# Altium schematic sheet power_supply.SchDoc: Power supply & supervisor
size 297 x 209 mm; CheckedBy: -; CompanyName: CERN; DrawnBy: GK; Organization: CERN; Address1: European Organization for Nuclear Research; Address2: CH-1211 Geneve 23 - Switzerland; DocumentNumber: 10; Revision: -; SheetNumber: 5; SheetTotal: 9; EDA_Number: EDA-02667-V2-0; Projet: FMC Delay 1ns 4cha; ModifiedBy: -; CheckedDate: -; Title2: -; DivGrp: BE-CO; Designer: GK; ModifiedDate: -
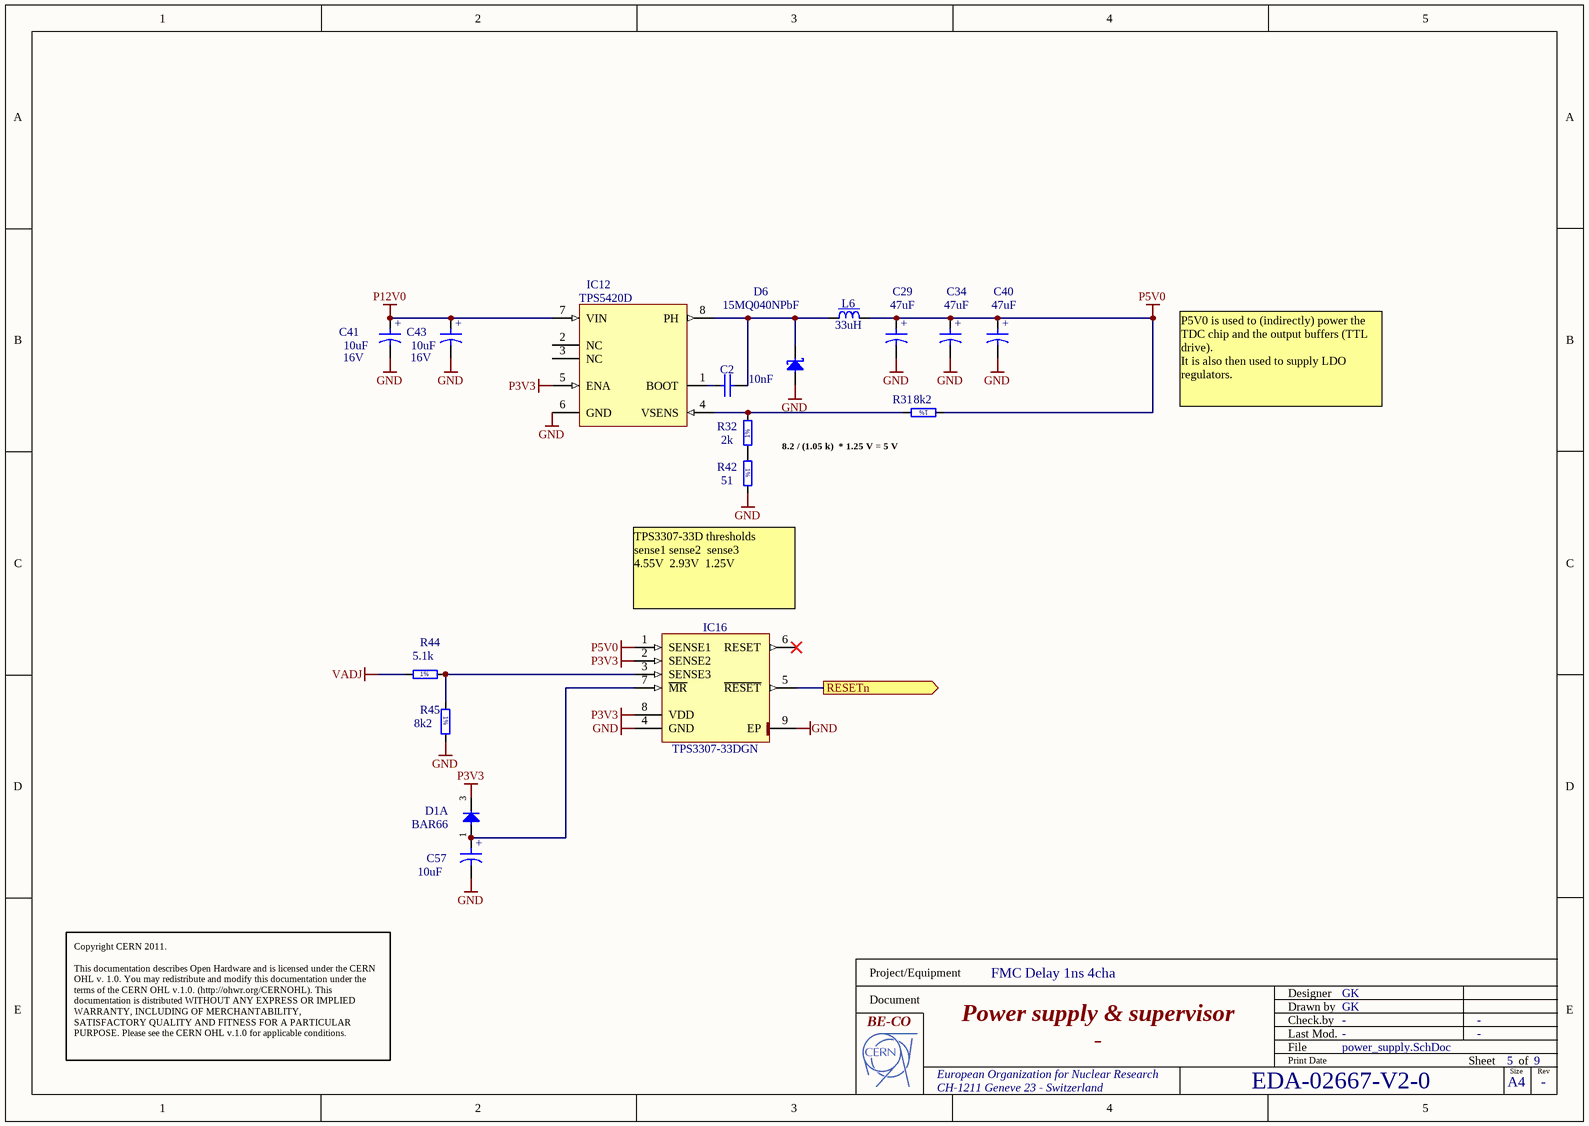
[diagram p0: power_supply.SchDoc]

## Parts
C2  10nF  [CAPC1608X87N]
C29  47uF  [CAPMP3528X210N]
C34  47uF  [CAPMP3528X210N]
C40  47uF  [CAPMP3528X210N]
C41  10uF  Voltage: 16V  [CAPMP3528X210N]
C43  10uF  Voltage: 16V  [CAPMP3528X210N]
C57  10uF  [CAPMP3216X180N]
D1  BAR66  [SOT95P240X110-3N]  (part A of 2)
D6  15MQ040NPbF  [DIOM5027X244N]
IC12  TPS5420D  [SOIC127P600X175-8N]
IC16  TPS3307-33DGN  [SOP65P490X110-9N-R157X189]
L6  33uH  [IND_MURATA-PS_4500]
R31  8k2  [RESC1608X55N]
R32  2k  [RESC1608X55N]
R42  51  [RESC1608X55N]
R44  5.1k  [RESC1608X55N]
R45  8k2  [RESC1608X55N]

## Ports
RESETn (out)

## Nets
GND: C29.2 C34.2 C40.2 C41.2 C43.2 C57.2 D6.2(A) IC12.6(GND) IC16.4(GND) IC16.9(EP) R42.2 R45.2
P3V3: D1.3(COMAC) IC12.5(ENA) IC16.2(SENSE2) IC16.8(VDD)
P5V0: C29.1 C34.1 C40.1 IC16.1(SENSE1) L6.2 R31.1
P12V0: C41.1 C43.1 IC12.7(VIN)
VADJ: R44.1
RESETn: IC16.5(~{RESET}) ; port RESETn
NetC2_1: C2.1 IC12.1(BOOT)
NetC2_2: C2.2 D6.1(C) IC12.8(PH) L6.1
NetC57_1: C57.1 D1.1(A) IC16.7(~{MR})
NetIC12_4: IC12.4(VSENS) R31.2 R32.2
NetIC16_3: IC16.3(SENSE3) R44.2 R45.1
NetR32_1: R32.1 R42.1

Not connected (* = marked no-connect by the designer): IC12 2(NC) 3(NC); IC16 6(RESET)*

## Notes on the sheet
- P5V0 is used to (indirectly) power the TDC chip and the output buffers (TTL drive).
  It is also then used to supply LDO regulators.
- 8.2 / (1.05 k)  * 1.25 V = 5 V
- TPS3307-33D thresholds
  sense1	sense2 	sense3
  4.55V 	2.93V 	1.25V
- Copyright CERN 2011.
  This documentation describes Open Hardware and is licensed under the CERN OHL v. 1.0. You may redistribute and modify this documentation under the terms of the CERN OHL v.1.0. (http://ohwr.org/CERNOHL). This documentation is distributed WITHOUT ANY EXPRESS OR IMPLIED WARRANTY, INCLUDING OF MERCHANTABILITY, SATISFACTORY QUALITY AND FITNESS FOR A PARTICULAR PURPOSE. Please see the CERN OHL v.1.0 for applicable conditions.
- Project/Equipment
- Document
- Designer
- Drawn by
- Check.by
- File
- Last Mod.
- Print Date
- Sheet
- Size
- A4
- of
- Rev
- (in symbol CTE3216-18_10UF_10V_10%_LESR1800) +
- (in symbol CTE3528-21_10UF_16V_10%_LESR0800) +
- (in symbol CTE3528-21_47UF_6.3V_10%_LESR0250) +
- (in symbol R0603_2K_1%_0.1W_100PPM) 1%
- (in symbol R0603_5K1_1%_0.1W_100PPM) 1%
- (in symbol R0603_8K2_1%_0.1W_100PPM) 1%
- (in symbol R0603_51R_1%_0.1W_100PPM) 1%

## Library data of the parts
C2 = CC0603_10NF_50V_10%_X7R: Non-polarised capacitor; Part Description: SMD Multilayer Chip Ceramic Capacitor; Manufacturer: GENERIC; Manufacturer1 Part Number: 223858615636; Voltage: 50V; TC: X7R; Tolerance: ±10%; Table: Capacitors SMD; Part Number: CC0603_10NF_50V_10%_X7R; Component Kind: Standard; Component Type: Standard; Pin Count: 2; Value: 10nF; Status: Preferred; Manufacturer Part Number: CC0603_10NF_50V_10%_X7R; Case: 0603; Mounted: Yes; Socket: No; SMD: Yes; Manufacturer1 Example: PHYCOMP; Manufacturer1 ComponentHeight: 0.87mm; HelpURL: \\cern.ch\dfs\Applications\Altium\Datasheets\CC0603_X7R_PHYCOMP.pdf; Author: CERN DEM JLC; CreateDate: 12/3/2007; LatestRevisionDate: 12/3/2007
C29 C34 C40 = CTE3528-21_47UF_6.3V_10%_LESR0250: Polarised capacitor; Part Description: Low ESR 0R25 Solid Tantalum Chip Capacitor; Manufacturer: GENERIC; Manufacturer1 Part Number: TPSB476K006R0250; Voltage: 6.3V; Tolerance: ±10%; Table: Capacitors SMD; Part Number: CTE3528-21_47UF_6.3V_10%_LESR0250; Component Kind: Standard; Component Type: Standard; Pin Count: 2; Value: 47uF; Status: Preferred; Manufacturer Part Number: CTE3528-21_47UF_6.3V_10%_LESR0250; Case: B; Mounted: Yes; Socket: No; SMD: Yes; Manufacturer1 Example: AVX; Manufacturer1 ComponentHeight: 2.1mm; HelpURL: \\cern.ch\dfs\Applications\Altium\Datasheets\CTE-LESR_AVX_TPS.pdf; Author: CERN DEM JLC; CreateDate: 5/5/2008; LatestRevisionDate: 1/20/2009
C41 C43 = CTE3528-21_10UF_16V_10%_LESR0800: Polarised capacitor; Part Description: Low ESR 0R8 Solid Tantalum Chip Capacitor; Manufacturer: GENERIC; Manufacturer1 Part Number: TPSB106K016R0800; Tolerance: ±10%; Table: Capacitors SMD; Part Number: CTE3528-21_10UF_16V_10%_LESR0800; Component Kind: Standard; Component Type: Standard; Pin Count: 2; Value: 10uF; Status: Preferred; Manufacturer Part Number: CTE3528-21_10UF_16V_10%_LESR0800; Case: B; Mounted: Yes; Socket: No; SMD: Yes; Manufacturer1 Example: AVX; Manufacturer1 ComponentHeight: 2.1mm; HelpURL: \\cern.ch\dfs\Applications\Altium\Datasheets\CTE-LESR_AVX_TPS.pdf; Author: CERN DEM JLC; CreateDate: 5/5/2008; LatestRevisionDate: 1/20/2009
C57 = CTE3216-18_10UF_10V_10%_LESR1800: Polarised capacitor; Part Description: Low ESR 1R8 Solid Tantalum Chip Capacitor; Manufacturer: GENERIC; Manufacturer1 Part Number: TPSA106K010R1800; Voltage: 10V; Tolerance: ±10%; Table: Capacitors SMD; Part Number: CTE3216-18_10UF_10V_10%_LESR1800; Component Kind: Standard; Component Type: Standard; Pin Count: 2; Value: 10uF; Status: Preferred; Manufacturer Part Number: CTE3216-18_10UF_10V_10%_LESR1800; Case: A; Mounted: Yes; Socket: No; SMD: Yes; Manufacturer1 Example: AVX; Manufacturer1 ComponentHeight: 1.8mm; HelpURL: \\cern.ch\dfs\Applications\Altium\Datasheets\CTE-LESR_AVX_TPS.pdf; Author: CERN DEM JLC; CreateDate: 5/5/2008; LatestRevisionDate: 1/20/2009
D1 = BAR66: Serial Diode; Part Description: Silicon PIN Diode Array (Series Connected); Manufacturer: INFINEON; Voltage: 150V; Power: 250mA; Table: Diodes; Part Number: BAR66; Component Kind: Standard; Component Type: Standard; Device: BAR66; PackageDescription: SOT23 3-Leads, Pitch 0.95mm - Body 1.3x2.9mm, IPC Medium Density; Manufacturer Part Number: BAR66; Pin Count: 3; Case: SOT23; Mounted: Yes; Socket: No; SMD: Yes; ComponentHeight: 1.1mm; HelpURL: \\cern.ch\dfs\Applications\Altium\Datasheets\BAR66.pdf; Author: CERN DEM JLC; CreateDate: 1/18/2010; LatestRevisionDate: 10/5/2010
D6 = 15MQ040NPbF: Schottky Diode; Part Description: Schottky Rectifier; Manufacturer: VISHAY INTERTECHNOLOGY, INC.; Voltage: 40V; Power: 3A; Table: Diodes; Part Number: 15MQ040NPbF; Component Kind: Standard; Component Type: Standard; Device: 15MQ040NPbF; PackageDescription: DO-214-AC/SMA  Molded Diode, Body 5.0x2.7mm, IPC Medium Density; Manufacturer Part Number: 15MQ040NPbF; Pin Count: 2; Case: DO-214AC; Mounted: Yes; Socket: No; SMD: Yes; ComponentHeight: 2.44mm; HelpURL: \\cern.ch\dfs\Applications\Altium\Datasheets\15MQ040NPbF.pdf; Author: CERN DEM JLC; CreateDate: 3/9/2009; LatestRevisionDate: 3/9/2009
IC12 = TPS5420D: 2A, Wide Input Range, Step-Down SWIFT Converter; Manufacturer: TEXAS INSTRUMENTS; Table: DC-DC Converters; Part Number: TPS5420D; Component Kind: Standard; Component Type: Standard; Device: TPS5420D; PackageDescription: SOIC 8, Pitch 1.27mm - Body 4x5mm, IPC Medium Density; Part Description: 2A, Wide Input Range, Step-Down SWIFT Converter; Manufacturer Part Number: TPS5420D; Pin Count: 8; Case: SOIC8; Mounted: Yes; Socket: No; SMD: Yes; ComponentHeight: 1.75mm; HelpURL: \\cern.ch\dfs\Applications\Altium\Datasheets\TPS5420D.pdf; Author: CERN DEM JLC; CreateDate: 11/17/2009; LatestRevisionDate: 11/17/2009
IC16 = TPS3307-33DGN: Triple Processor Supervisors; Manufacturer: TEXAS INSTRUMENTS; Table: Analog & Interface; Part Number: TPS3307-33DGN; Component Kind: Standard; Component Type: Standard; Device: TPS3307-33DGN; PackageDescription: SOP,0.65mm,pitch; 8 pin,3.00mm W X 3.00mm L X 1.10mm H body (w/thermal tab 1.57 X 1.89 mm), IPC Medium Density; Part Description: Triple Processor Supervisors; Manufacturer Part Number: TPS3307-33DGN; Pin Count: 9; Case: TSSOP8; Mounted: Yes; Socket: No; SMD: Yes; ComponentHeight: 1.1mm; Author: CERN DEM JLC; HelpURL: \\cern.ch\dfs\Applications\Altium\Datasheets\TPS3307-33DGN.pdf; CreateDate: 1/10/2011; LatestRevisionDate: 1/10/2011
L6 = IND_33UH_20%_MURATA-PS_4500: Inductor With Magnetic core; Part Description: Shielded Surface Mount Power Inductors (4500 Serie); Manufacturer: MURATA; Manufacturer Part Number: 45333C; Power: 1.25A; Resistance: 0.25R; Tolerance: ±20%; Table: Inductors SMD; Part Number: IND_33UH_20%_MURATA-PS_4500; Component Kind: Standard; Component Type: Standard; Pin Count: 2; Value: 33uH; Status: None; Mounted: Yes; Socket: No; SMD: Yes; ComponentHeight: 3.55mm; HelpURL: \\cern.ch\dfs\Applications\Altium\Datasheets\IND_MURATA-PS_4500.pdf; Author: CERN DEM JLC; CreateDate: 1/10/2011; LatestRevisionDate: 1/10/2011
R31 R45 = R0603_8K2_1%_0.1W_100PPM: Resistor - 1%; Part Description: General Purpose Thick Film Chip Resistor; Manufacturer: GENERIC; Manufacturer1 Part Number: NRC06F8201TRF; Power: 0.1W; TC: ±100ppm/°C; Table: Resistors SMD; Part Number: R0603_8K2_1%_0.1W_100PPM; Component Kind: Standard; Component Type: Standard; Pin Count: 2; Value: 8k2; Status: Preferred; Tolerance: ±1%; Manufacturer Part Number: R0603_8K2_1%_0.1W_100PPM; Case: 0603; Mounted: Yes; Socket: No; SMD: Yes; Manufacturer1 Example: NIC COMPONENT; Manufacturer1 ComponentHeight: 0.55mm; HelpURL: \\cern.ch\dfs\Applications\Altium\Datasheets\R0603_NIC_NRC.pdf; Author: CERN DEM JLC; CreateDate: 12/3/2007; LatestRevisionDate: 3/13/2008
R32 = R0603_2K_1%_0.1W_100PPM: Resistor - 1%; Part Description: General Purpose Thick Film Chip Resistor; Manufacturer: GENERIC; Manufacturer1 Part Number: NRC06F2001TRF; Power: 0.1W; TC: ±100ppm/°C; Table: Resistors SMD; Part Number: R0603_2K_1%_0.1W_100PPM; Component Kind: Standard; Component Type: Standard; Pin Count: 2; Value: 2k; Status: Preferred; Tolerance: ±1%; Manufacturer Part Number: R0603_2K_1%_0.1W_100PPM; Case: 0603; Mounted: Yes; Socket: No; SMD: Yes; Manufacturer1 Example: NIC COMPONENT; Manufacturer1 ComponentHeight: 0.55mm; HelpURL: \\cern.ch\dfs\Applications\Altium\Datasheets\R0603_NIC_NRC.pdf; Author: CERN DEM JLC; CreateDate: 12/3/2007; LatestRevisionDate: 3/13/2008
R42 = R0603_51R_1%_0.1W_100PPM: Resistor - 1%; Part Description: General Purpose Thick Film Chip Resistor; Manufacturer: GENERIC; Manufacturer1 Part Number: NRC06F51R0TRF; Power: 0.1W; TC: ±100ppm/°C; Table: Resistors SMD; Part Number: R0603_51R_1%_0.1W_100PPM; Component Kind: Standard; Component Type: Standard; Pin Count: 2; Value: 51; Status: Preferred; Tolerance: ±1%; Manufacturer Part Number: R0603_51R_1%_0.1W_100PPM; Case: 0603; Mounted: Yes; Socket: No; SMD: Yes; Manufacturer1 Example: NIC COMPONENT; Manufacturer1 ComponentHeight: 0.55mm; HelpURL: \\cern.ch\dfs\Applications\Altium\Datasheets\R0603_NIC_NRC.pdf; Author: CERN DEM JLC; CreateDate: 12/3/2007; LatestRevisionDate: 3/13/2008
R44 = R0603_5K1_1%_0.1W_100PPM: Resistor - 1%; Part Description: General Purpose Thick Film Chip Resistor; Manufacturer: GENERIC; Manufacturer1 Part Number: NRC06F5101TRF; Value: 5k1; Power: 0.1W; TC: ±100ppm/°C; Table: Resistors SMD; Part Number: R0603_5K1_1%_0.1W_100PPM; Component Kind: Standard; Component Type: Standard; Designator: Resistor - 1%; Library Reference: Resistor - 1%; Pin Count: 2; Status: Preferred; Tolerance: ±1%; Manufacturer Part Number: R0603_5K1_1%_0.1W_100PPM; Case: 0603; Mounted: Yes; Socket: No; SMD: Yes; Manufacturer1 Example: NIC COMPONENT; Manufacturer1 ComponentHeight: 0.55mm; HelpURL: \\cern.ch\dfs\Applications\Altium\Datasheets\R0603_NIC_NRC.pdf; Author: CERN DEM JLC; CreateDate: 12/3/2007; LatestRevisionDate: 3/13/2008